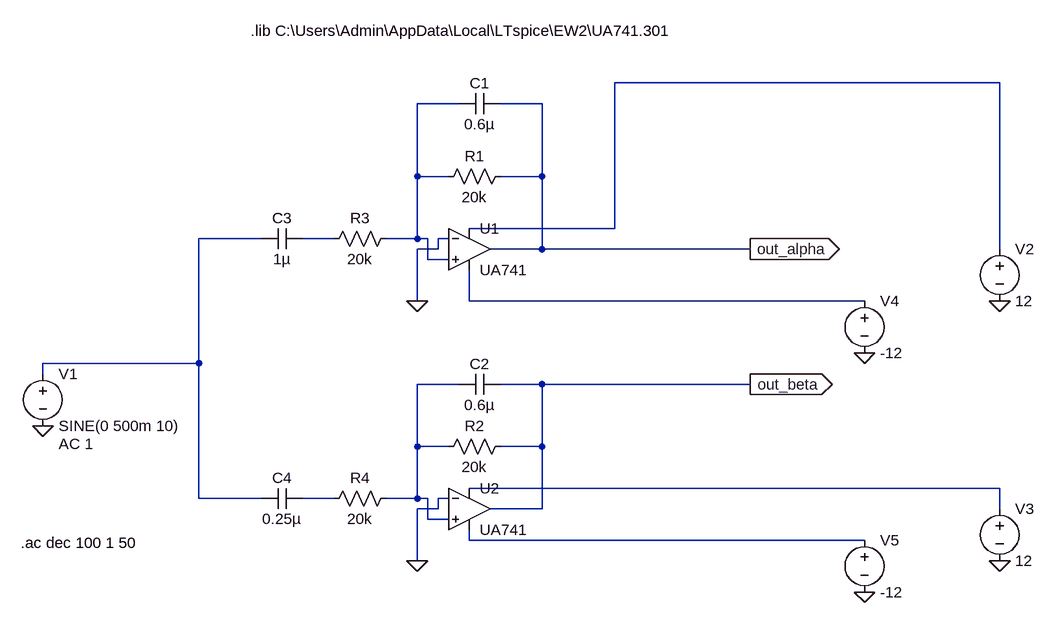
[diagram p0: schematic EW2_project2_bandpass_iter1.asc]
EW2_project2_bandpass_iter1.asc, the LTspice schematic file:
Version 4
SHEET 1 1032 680
WIRE 976 -336 384 -336
WIRE 144 -304 80 -304
WIRE 272 -304 208 -304
WIRE 80 -192 80 -304
WIRE 128 -192 80 -192
WIRE 272 -192 272 -304
WIRE 272 -192 208 -192
WIRE 384 -112 384 -336
WIRE 384 -112 160 -112
WIRE -160 -96 -256 -96
WIRE -48 -96 -96 -96
WIRE 80 -96 80 -192
WIRE 80 -96 32 -96
WIRE 96 -96 80 -96
WIRE 128 -96 112 -96
WIRE 112 -80 112 -96
WIRE 112 -80 80 -80
WIRE 272 -80 272 -192
WIRE 272 -80 192 -80
WIRE 592 -80 272 -80
WIRE 976 -80 976 -336
WIRE 96 -64 96 -96
WIRE 128 -64 96 -64
WIRE 80 0 80 -80
WIRE 160 0 160 -48
WIRE 768 0 160 0
WIRE -256 96 -256 -96
WIRE -256 96 -496 96
WIRE -496 112 -496 96
WIRE 144 128 80 128
WIRE 272 128 208 128
WIRE 592 128 272 128
WIRE 80 224 80 128
WIRE 128 224 80 224
WIRE 272 224 272 128
WIRE 272 224 208 224
WIRE 976 288 160 288
WIRE -256 304 -256 96
WIRE -160 304 -256 304
WIRE -48 304 -96 304
WIRE 80 304 80 224
WIRE 80 304 32 304
WIRE 96 304 80 304
WIRE 128 304 112 304
WIRE 112 320 112 304
WIRE 112 320 80 320
WIRE 272 320 272 224
WIRE 272 320 192 320
WIRE 976 320 976 288
WIRE 96 336 96 304
WIRE 128 336 96 336
WIRE 160 368 160 352
WIRE 768 368 160 368
WIRE 80 400 80 320
FLAG -496 192 0
FLAG 592 -80 out_alpha
IOPIN 592 -80 Out
FLAG 592 128 out_beta
IOPIN 592 128 Out
FLAG 976 0 0
FLAG 976 400 0
FLAG 80 0 0
FLAG 80 400 0
FLAG 768 80 0
FLAG 768 448 0
SYMBOL OpAmps\\opamp2 160 -144 R0
SYMATTR InstName U1
SYMATTR Value UA741
SYMBOL OpAmps\\opamp2 160 256 R0
SYMATTR InstName U2
SYMATTR Value UA741
SYMBOL res 224 -208 R90
WINDOW 0 0 56 VBottom 2
WINDOW 3 32 56 VTop 2
SYMATTR InstName R1
SYMATTR Value 20k
SYMBOL res 224 208 R90
WINDOW 0 0 56 VBottom 2
WINDOW 3 32 56 VTop 2
SYMATTR InstName R2
SYMATTR Value 20k
SYMBOL cap 208 -320 R90
WINDOW 0 0 32 VBottom 2
WINDOW 3 32 32 VTop 2
SYMATTR InstName C1
SYMATTR Value 0.6µ
SYMBOL cap 208 112 R90
WINDOW 0 0 32 VBottom 2
WINDOW 3 32 32 VTop 2
SYMATTR InstName C2
SYMATTR Value 0.6µ
SYMBOL cap -96 -112 R90
WINDOW 0 0 32 VBottom 2
WINDOW 3 32 32 VTop 2
SYMATTR InstName C3
SYMATTR Value 1µ
SYMBOL cap -96 288 R90
WINDOW 0 0 32 VBottom 2
WINDOW 3 32 32 VTop 2
SYMATTR InstName C4
SYMATTR Value 0.25µ
SYMBOL res 48 -112 R90
WINDOW 0 0 56 VBottom 2
WINDOW 3 32 56 VTop 2
SYMATTR InstName R3
SYMATTR Value 20k
SYMBOL res 48 288 R90
WINDOW 0 0 56 VBottom 2
WINDOW 3 32 56 VTop 2
SYMATTR InstName R4
SYMATTR Value 20k
SYMBOL voltage -496 96 R0
WINDOW 123 24 124 Left 2
WINDOW 39 0 0 Left 0
SYMATTR InstName V1
SYMATTR Value SINE(0 500m 10)
SYMATTR Value2 AC 1
SYMBOL voltage 976 -96 R0
WINDOW 123 0 0 Left 0
WINDOW 39 0 0 Left 0
SYMATTR InstName V2
SYMATTR Value 12
SYMBOL voltage 976 304 R0
WINDOW 123 0 0 Left 0
WINDOW 39 0 0 Left 0
SYMATTR InstName V3
SYMATTR Value 12
SYMBOL voltage 768 -16 R0
WINDOW 123 0 0 Left 0
WINDOW 39 0 0 Left 0
SYMATTR InstName V4
SYMATTR Value -12
SYMBOL voltage 768 352 R0
WINDOW 123 0 0 Left 0
WINDOW 39 0 0 Left 0
SYMATTR InstName V5
SYMATTR Value -12
TEXT -530 372 Left 2 !.ac dec 100 1 50
TEXT -176 -416 Left 2 !.lib C:\\Users\\Admin\\AppData\\Local\\LTspice\\EW2\\UA741.301

The netlist it stands for:
* EW2_project2_bandpass_iter1.asc
XU1 N002 0 N001 N005 out_alpha UA741  ; pins In+ In- V+ V- OUT
XU2 N006 0 N007 N009 out_beta UA741  ; pins In+ In- V+ V- OUT
R1 out_alpha N002 20k
R2 out_beta N006 20k
C1 out_alpha N002 0.6µ
C2 out_beta N006 0.6µ
C3 N004 N003 1µ
C4 N008 N003 0.25µ
R3 N002 N004 20k
R4 N006 N008 20k
V1 N003 0 SINE(0 500m 10) AC 1
V2 N001 0 12
V3 N007 0 12
V4 N005 0 -12
V5 N009 0 -12
.ac dec 100 1 50
.lib C:\Users\Admin\AppData\Local\LTspice\EW2\UA741.301
.backanno
.end